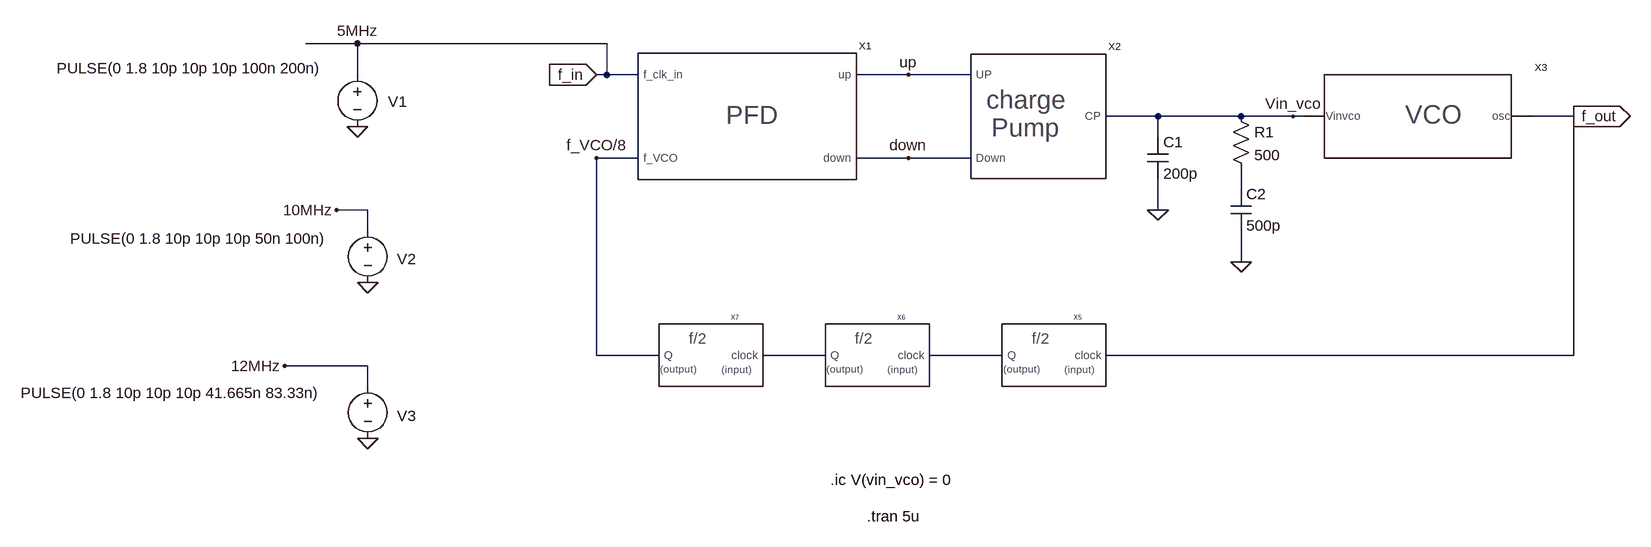
[diagram p0: schematic Final_PLL_501.asc]
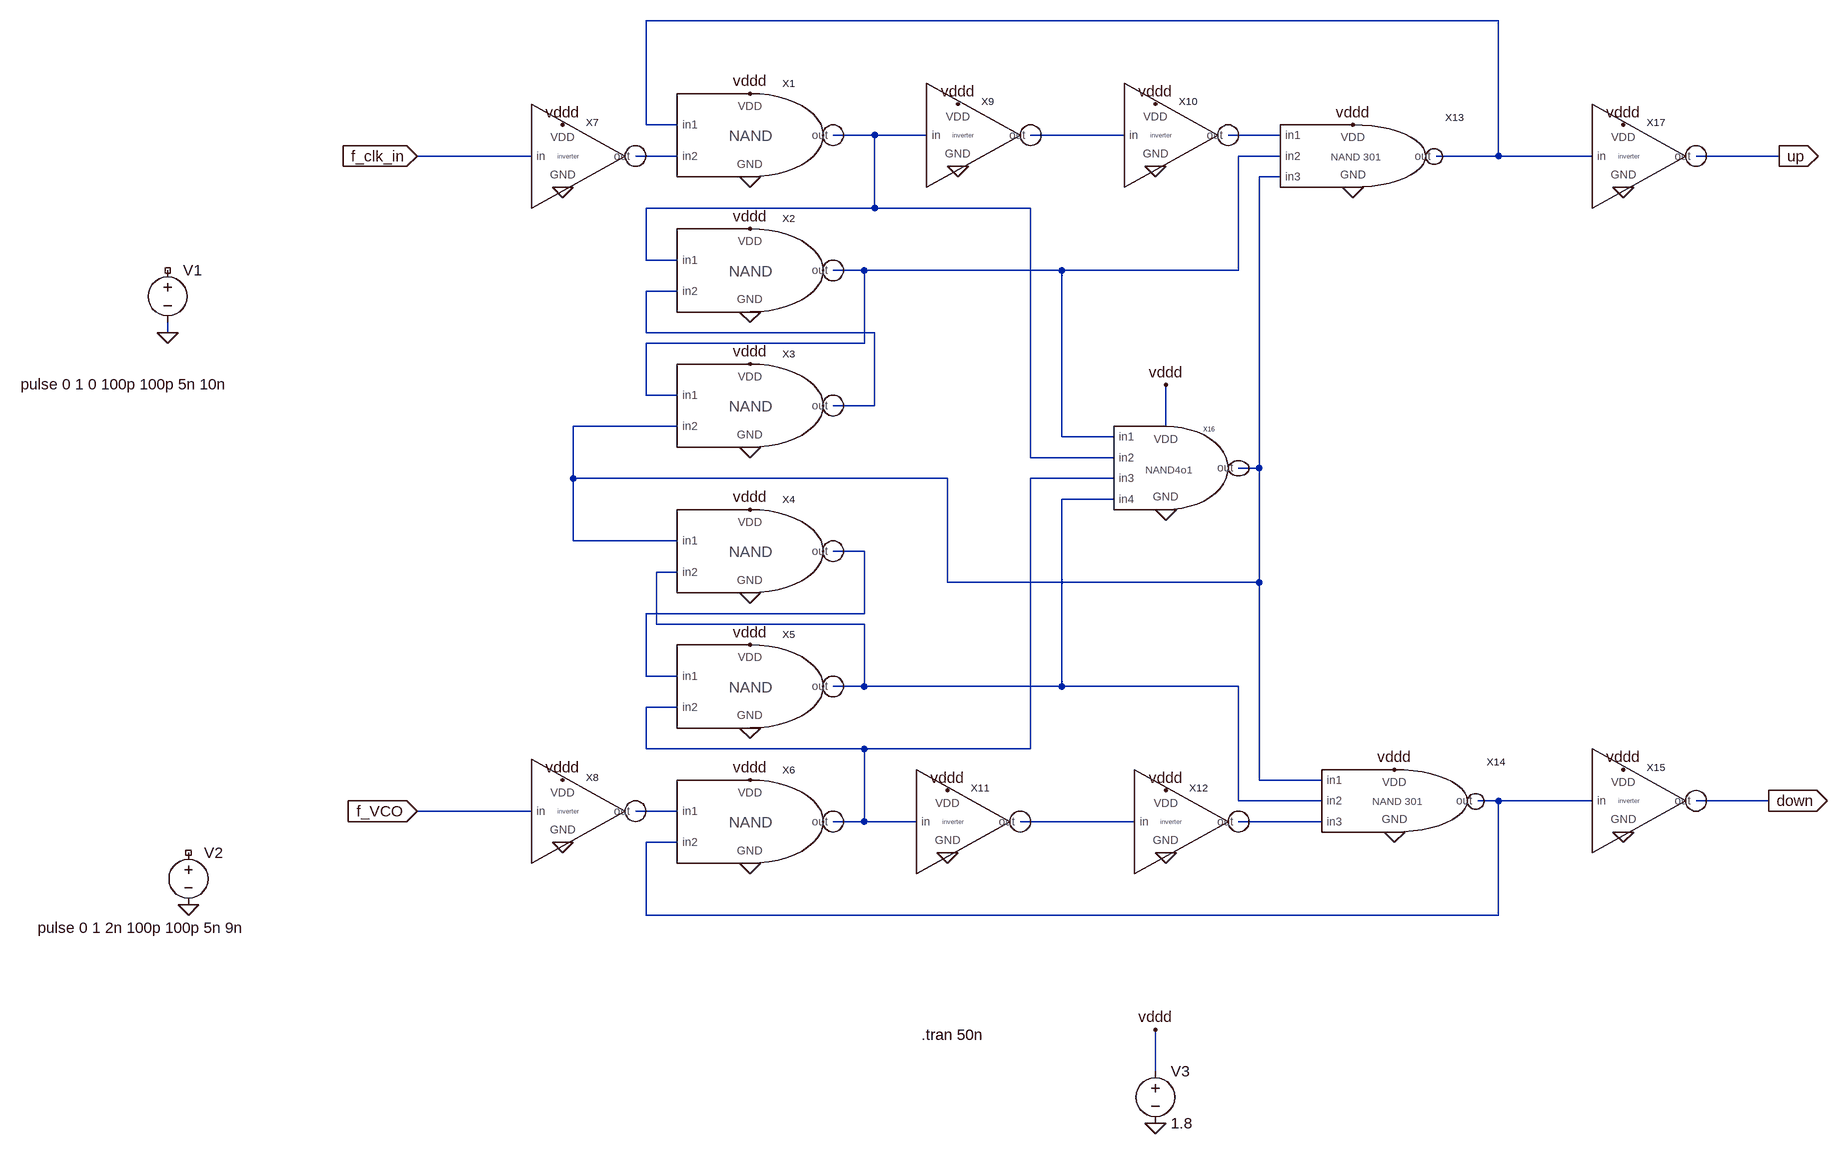
[diagram p1: sub-circuit pfd_501.asc]
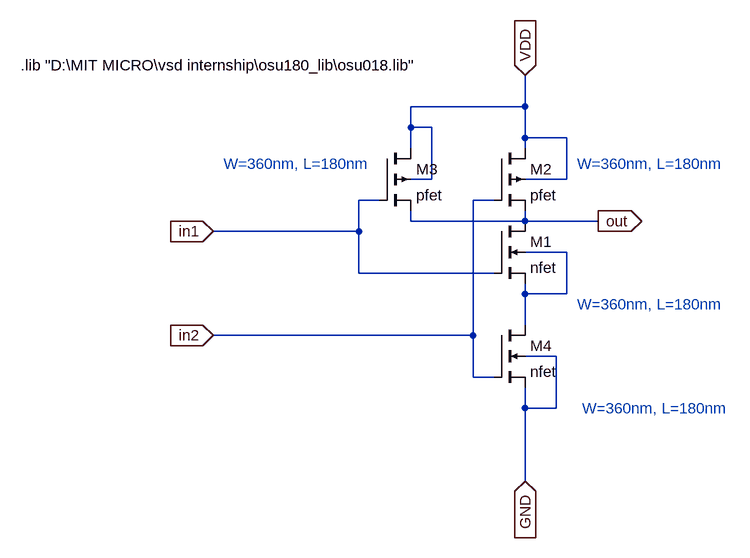
[diagram p2: sub-circuit nand101.asc]
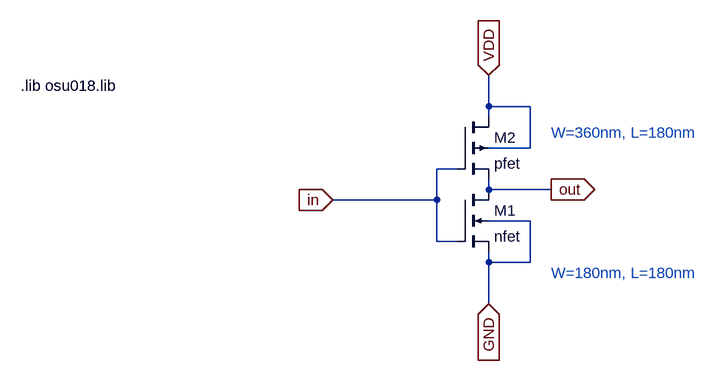
[diagram p3: sub-circuit inv101.asc]
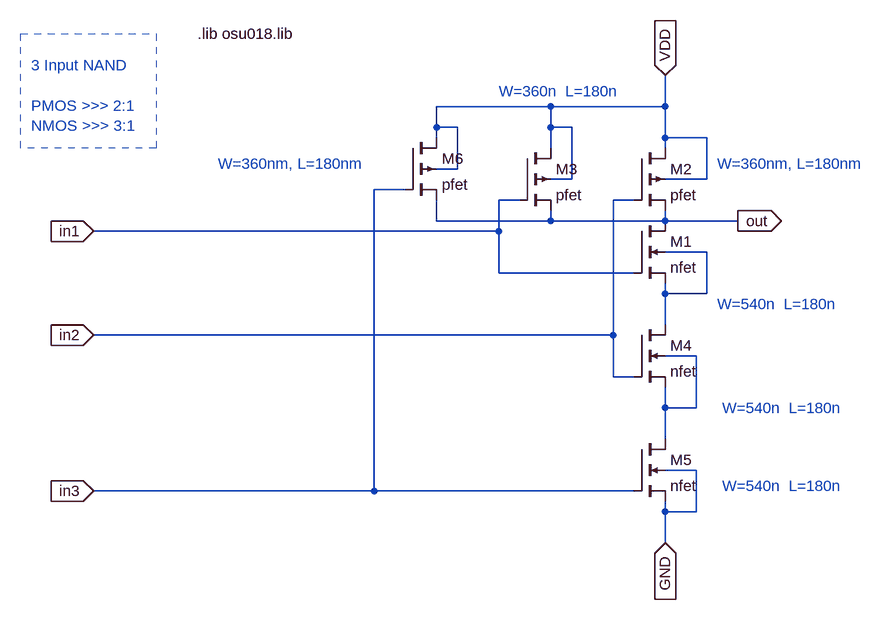
[diagram p4: sub-circuit nand301.asc]
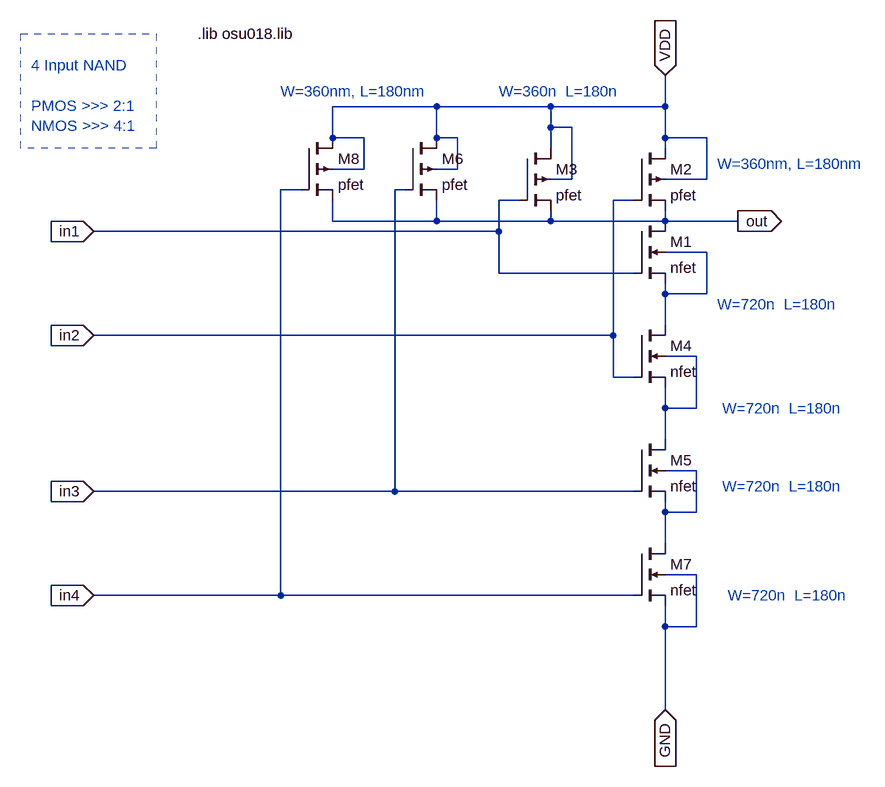
[diagram p5: sub-circuit nand401.asc]
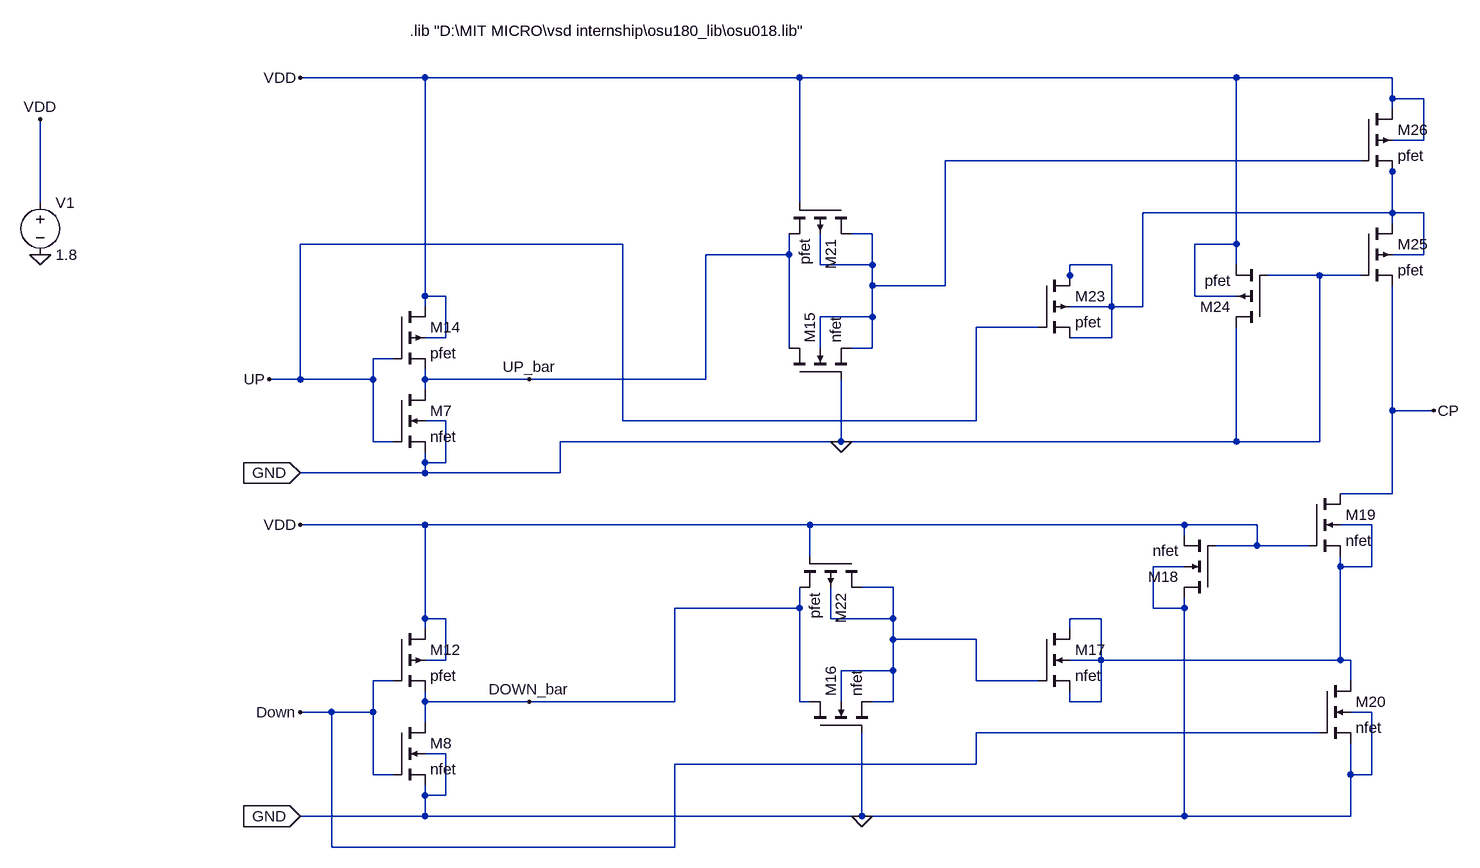
[diagram p6: sub-circuit charge_pump.asc]
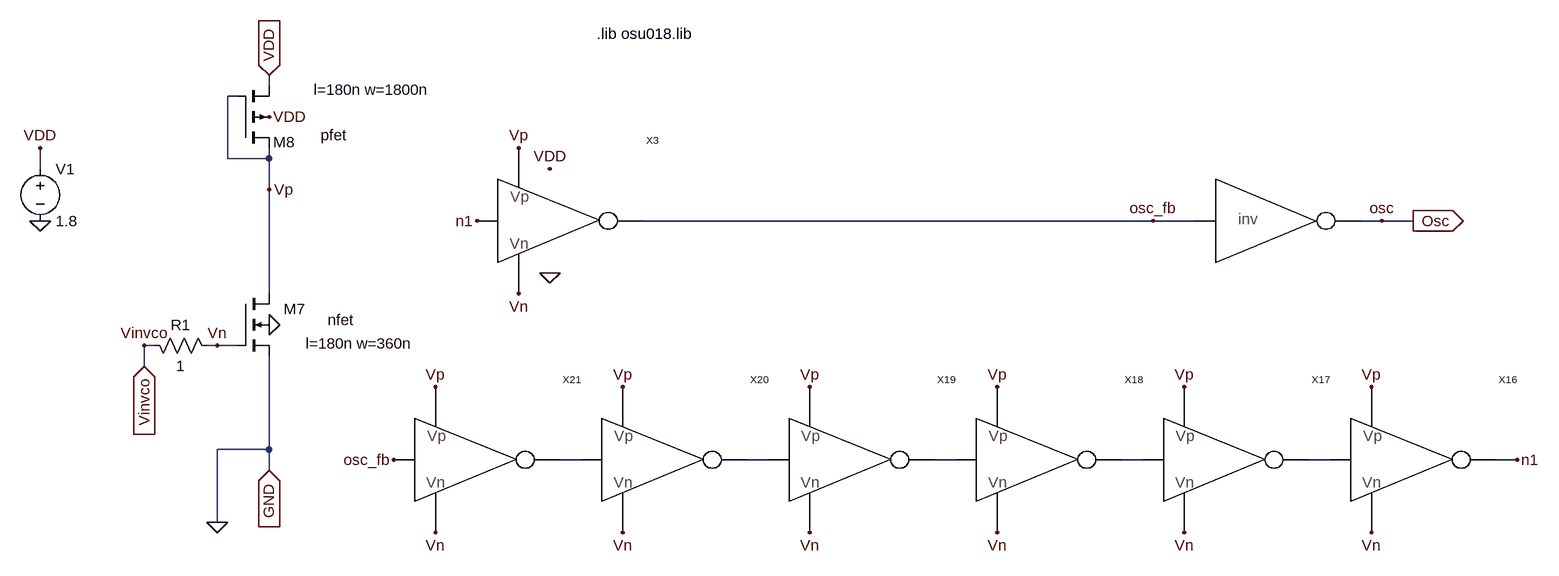
[diagram p7: sub-circuit vco_19_16.asc]
Final_PLL_501.asc, the LTspice schematic file:
Version 4
SHEET 1 1464 760
WIRE -528 16 -608 16
WIRE -144 16 -528 16
WIRE -528 64 -528 16
WIRE -144 64 -144 16
WIRE -144 64 -160 64
WIRE -96 64 -144 64
WIRE 320 64 240 64
WIRE 416 64 320 64
WIRE 704 128 624 128
WIRE 832 128 704 128
WIRE 912 128 832 128
WIRE 928 128 912 128
WIRE 1344 128 1280 128
WIRE 704 160 704 128
WIRE -96 192 -160 192
WIRE 320 192 240 192
WIRE 416 192 320 192
WIRE 832 240 832 208
WIRE -512 272 -560 272
WIRE 704 272 704 224
WIRE -512 304 -512 272
WIRE 832 352 832 304
WIRE -160 496 -160 192
WIRE -64 496 -160 496
WIRE 192 496 96 496
WIRE 464 496 352 496
WIRE 1344 496 1344 128
WIRE 1344 496 624 496
WIRE -512 512 -640 512
WIRE -512 544 -512 512
FLAG 1344 128 f_out
IOPIN 1344 128 Out
FLAG -160 64 f_in
IOPIN -160 64 In
FLAG -528 144 0
FLAG -512 384 0
FLAG -512 624 0
FLAG -528 16 5MHz
FLAG -560 272 10MHz
FLAG -640 512 12MHz
FLAG 320 64 up
FLAG 320 192 down
FLAG 912 128 Vin_vco
FLAG -160 192 f_VCO/8
FLAG 832 352 0
FLAG 704 272 0
SYMBOL pfd_501 80 128 R0
SYMATTR InstName X1
SYMBOL charge_pump 480 112 R0
SYMATTR InstName X2
SYMBOL VCO_19_16 880 128 R0
SYMATTR InstName X3
SYMBOL freq_div_2 544 496 R0
SYMATTR InstName X5
SYMBOL freq_div_2 272 496 R0
SYMATTR InstName X6
SYMBOL freq_div_2 16 496 R0
SYMATTR InstName X7
SYMBOL voltage -528 48 R0
WINDOW 3 -463 6 Left 2
WINDOW 123 0 0 Left 0
WINDOW 39 0 0 Left 0
WINDOW 0 47 57 Left 2
SYMATTR Value PULSE(0 1.8 10p 10p 10p 100n 200n)
SYMATTR InstName V1
SYMBOL voltage -512 288 R0
WINDOW 3 -458 28 Left 2
WINDOW 123 0 0 Left 0
WINDOW 39 0 0 Left 0
WINDOW 0 45 60 Left 2
SYMATTR Value PULSE(0 1.8 10p 10p 10p 50n 100n)
SYMATTR InstName V2
SYMBOL voltage -512 528 R0
WINDOW 3 -534 26 Left 2
WINDOW 123 0 0 Left 0
WINDOW 39 0 0 Left 0
WINDOW 0 45 61 Left 2
SYMATTR Value PULSE(0 1.8 10p 10p 10p 41.665n 83.33n)
SYMATTR InstName V3
SYMBOL cap 688 160 R0
SYMATTR InstName C1
SYMATTR Value 200p
SYMBOL cap 816 240 R0
SYMATTR InstName C2
SYMATTR Value 500p
SYMBOL res 816 112 R0
SYMATTR InstName R1
SYMATTR Value 500
TEXT 256 744 Left 2 !.tran 5u
TEXT 200 688 Left 2 !.ic V(vin_vco) = 0

pfd_501.asc, the sub-circuit schematic file:
Version 4
SHEET 1 2504 1444
WIRE 1248 -272 -64 -272
WIRE -64 -112 -64 -272
WIRE -16 -112 -64 -112
WIRE 288 -96 224 -96
WIRE 368 -96 288 -96
WIRE 672 -96 528 -96
WIRE 912 -96 832 -96
WIRE -240 -64 -416 -64
WIRE -16 -64 -80 -64
WIRE 912 -64 848 -64
WIRE 1248 -64 1248 -272
WIRE 1248 -64 1152 -64
WIRE 1392 -64 1248 -64
WIRE 1680 -64 1552 -64
WIRE 912 -32 880 -32
WIRE 288 16 288 -96
WIRE 288 16 -64 16
WIRE 528 16 288 16
WIRE -64 96 -64 16
WIRE -16 96 -64 96
WIRE 272 112 224 112
WIRE 576 112 272 112
WIRE 848 112 848 -64
WIRE 848 112 576 112
WIRE -16 144 -64 144
WIRE -800 208 -800 192
WIRE -64 208 -64 144
WIRE 288 208 -64 208
WIRE 272 224 272 112
WIRE 272 224 -64 224
WIRE -64 304 -64 224
WIRE -16 304 -64 304
WIRE 288 320 288 208
WIRE 288 320 224 320
WIRE -16 352 -176 352
WIRE 736 352 736 288
WIRE 576 368 576 112
WIRE 656 368 576 368
WIRE 528 400 528 16
WIRE 656 400 528 400
WIRE 880 416 880 -32
WIRE 880 416 848 416
WIRE -176 432 -176 352
WIRE 400 432 -176 432
WIRE 656 432 528 432
WIRE 656 464 576 464
WIRE -176 528 -176 432
WIRE -16 528 -176 528
WIRE 272 544 224 544
WIRE -16 576 -48 576
WIRE 400 592 400 432
WIRE 880 592 880 416
WIRE 880 592 400 592
WIRE 272 640 272 544
WIRE 272 640 -64 640
WIRE -48 656 -48 576
WIRE 272 656 -48 656
WIRE -64 736 -64 640
WIRE -16 736 -64 736
WIRE 272 752 272 656
WIRE 272 752 224 752
WIRE 576 752 576 464
WIRE 576 752 272 752
WIRE 848 752 576 752
WIRE -16 784 -64 784
WIRE -64 848 -64 784
WIRE 272 848 -64 848
WIRE 528 848 528 432
WIRE 528 848 272 848
WIRE 880 896 880 592
WIRE 976 896 880 896
WIRE 848 928 848 752
WIRE 976 928 848 928
WIRE 1248 928 1216 928
WIRE 1392 928 1248 928
WIRE 1664 928 1552 928
WIRE -240 944 -416 944
WIRE -16 944 -80 944
WIRE 272 960 272 848
WIRE 272 960 224 960
WIRE 352 960 272 960
WIRE 688 960 512 960
WIRE 976 960 848 960
WIRE -16 992 -64 992
WIRE -64 1104 -64 992
WIRE 1248 1104 1248 928
WIRE 1248 1104 -64 1104
WIRE 720 1344 720 1280
FLAG -416 -64 f_clk_in
IOPIN -416 -64 In
FLAG -416 944 f_VCO
IOPIN -416 944 In
FLAG 1680 -64 up
IOPIN 1680 -64 Out
FLAG 1664 928 down
IOPIN 1664 928 Out
FLAG -800 208 0
FLAG -768 1088 0
FLAG 1440 -16 0
FLAG 1024 -16 0
FLAG 720 -48 0
FLAG 416 -48 0
FLAG 96 -32 0
FLAG 96 176 0
FLAG 96 384 0
FLAG 96 608 0
FLAG -192 -16 0
FLAG 96 816 0
FLAG 96 1024 0
FLAG 400 1008 0
FLAG 736 1008 0
FLAG 1088 976 0
FLAG 1440 976 0
FLAG -192 992 0
FLAG -192 -112 vddd
FLAG 96 -160 vddd
FLAG 416 -144 vddd
FLAG 720 -144 vddd
FLAG 96 48 vddd
FLAG 1024 -112 vddd
FLAG 1440 -112 vddd
FLAG 736 288 vddd
FLAG 96 256 vddd
FLAG 96 480 vddd
FLAG 96 688 vddd
FLAG 96 896 vddd
FLAG 400 912 vddd
FLAG 736 912 vddd
FLAG 1088 880 vddd
FLAG -192 896 vddd
FLAG 1440 880 vddd
FLAG 720 1424 0
FLAG 720 1280 vddd
FLAG 736 480 0
SYMBOL nand101 64 -96 R0
SYMATTR InstName X1
SYMBOL nand101 64 112 R0
SYMATTR InstName X2
SYMBOL nand101 64 320 R0
SYMATTR InstName X3
SYMBOL nand101 64 544 R0
SYMATTR InstName X4
SYMBOL nand101 64 752 R0
SYMATTR InstName X5
SYMBOL nand101 64 960 R0
SYMATTR InstName X6
SYMBOL inv101 -192 -64 R0
SYMATTR InstName X7
SYMBOL inv101 -192 944 R0
SYMATTR InstName X8
SYMBOL inv101 416 -96 R0
SYMATTR InstName X9
SYMBOL inv101 720 -96 R0
SYMATTR InstName X10
SYMBOL inv101 400 960 R0
SYMATTR InstName X11
SYMBOL inv101 736 960 R0
SYMATTR InstName X12
SYMBOL nand301 976 -64 R0
SYMATTR InstName X13
SYMBOL nand301 1040 928 R0
SYMATTR InstName X14
SYMBOL inv101 1440 928 R0
SYMATTR InstName X15
SYMBOL nand401 720 400 R0
SYMATTR InstName X16
SYMBOL inv101 1440 -64 R0
SYMATTR InstName X17
SYMBOL voltage -800 96 R0
WINDOW 3 -226 191 Left 2
WINDOW 123 0 0 Left 0
WINDOW 39 0 0 Left 0
SYMATTR Value pulse 0 1 0 100p 100p 5n 10n
SYMATTR InstName V1
SYMBOL voltage -768 992 R0
WINDOW 3 -232 131 Left 2
WINDOW 123 0 0 Left 0
WINDOW 39 0 0 Left 0
SYMATTR Value pulse 0 1 2n 100p 100p 5n 9n
SYMATTR InstName V2
SYMBOL voltage 720 1328 R0
WINDOW 123 0 0 Left 0
WINDOW 39 0 0 Left 0
SYMATTR InstName V3
SYMATTR Value 1.8
TEXT 360 1288 Left 2 !.tran 50n

nand101.asc, the sub-circuit schematic file:
Version 4
SHEET 1 880 708
WIRE 272 0 272 -48
WIRE 272 0 96 0
WIRE 96 32 96 0
WIRE 128 32 96 32
WIRE 272 48 272 0
WIRE 336 48 272 48
WIRE 96 64 96 32
WIRE 272 64 272 48
WIRE 128 112 128 32
WIRE 128 112 96 112
WIRE 336 112 336 48
WIRE 336 112 272 112
WIRE 48 144 16 144
WIRE 224 144 192 144
WIRE 96 176 96 160
WIRE 272 176 272 160
WIRE 272 176 96 176
WIRE 384 176 272 176
WIRE 16 192 16 144
WIRE 16 192 -208 192
WIRE 336 224 272 224
WIRE 16 256 16 192
WIRE 224 256 16 256
WIRE 272 288 272 272
WIRE 336 288 336 224
WIRE 336 288 272 288
WIRE 272 336 272 288
WIRE 192 352 192 144
WIRE 192 352 -208 352
WIRE 320 384 272 384
WIRE 192 416 192 352
WIRE 224 416 192 416
WIRE 272 464 272 432
WIRE 320 464 320 384
WIRE 320 464 272 464
WIRE 272 576 272 464
FLAG 384 176 out
IOPIN 384 176 Out
FLAG -208 192 in1
IOPIN -208 192 In
FLAG 272 -48 VDD
IOPIN 272 -48 In
FLAG 272 576 GND
IOPIN 272 576 In
FLAG -208 352 in2
IOPIN -208 352 In
SYMBOL nmos4 224 176 R0
SYMATTR InstName M1
SYMATTR Value2 l=180n w=180n
SYMATTR Value nfet
SYMBOL pmos4 224 64 R0
SYMATTR InstName M2
SYMATTR Value2 l=180n w=360n
SYMATTR Value pfet
SYMBOL pmos4 48 64 R0
SYMATTR InstName M3
SYMATTR Value pfet
SYMATTR Value2 l=180n w=360n
SYMBOL nmos4 224 336 R0
SYMATTR InstName M4
SYMATTR Value nfet
SYMATTR Value2 l=180n w=360n
TEXT -504 -64 Left 2 !.lib "D:\\MIT MICRO\\vsd internship\\osu180_lib\\osu018.lib"
TEXT 352 304 Left 2 ;W=360nm, L=180nm
TEXT 352 88 Left 2 ;W=360nm, L=180nm
TEXT 360 464 Left 2 ;W=360nm, L=180nm
TEXT -192 88 Left 2 ;W=360nm, L=180nm

inv101.asc, the sub-circuit schematic file:
Version 4
SHEET 1 880 680
WIRE 256 48 256 0
WIRE 320 48 256 48
WIRE 256 64 256 48
WIRE 320 112 320 48
WIRE 320 112 256 112
WIRE 208 144 176 144
WIRE 256 176 256 160
WIRE 352 176 256 176
WIRE 176 192 176 144
WIRE 176 192 16 192
WIRE 320 224 256 224
WIRE 176 256 176 192
WIRE 208 256 176 256
WIRE 256 288 256 272
WIRE 320 288 320 224
WIRE 320 288 256 288
WIRE 256 352 256 288
FLAG 352 176 out
IOPIN 352 176 Out
FLAG 16 192 in
IOPIN 16 192 In
FLAG 256 0 VDD
IOPIN 256 0 In
FLAG 256 352 GND
IOPIN 256 352 In
SYMBOL nmos4 208 176 R0
SYMATTR InstName M1
SYMATTR Value2 l=180n w=180n
SYMATTR Value nfet
SYMBOL pmos4 208 64 R0
SYMATTR InstName M2
SYMATTR Value2 l=180n w=360n
SYMATTR Value pfet
TEXT -464 16 Left 2 !.lib osu018.lib
TEXT 352 304 Left 2 ;W=180nm, L=180nm
TEXT 352 88 Left 2 ;W=360nm, L=180nm

nand301.asc, the sub-circuit schematic file:
Version 4
SHEET 1 916 896
WIRE 96 0 -80 0
WIRE 272 0 272 -48
WIRE 272 0 96 0
WIRE -80 32 -80 0
WIRE -48 32 -80 32
WIRE 96 32 96 0
WIRE 128 32 96 32
WIRE -80 48 -80 32
WIRE 272 48 272 0
WIRE 336 48 272 48
WIRE 96 64 96 32
WIRE 272 64 272 48
WIRE -48 96 -48 32
WIRE -48 96 -80 96
WIRE 128 112 128 32
WIRE 128 112 96 112
WIRE 336 112 336 48
WIRE 336 112 272 112
WIRE -128 128 -176 128
WIRE 48 144 16 144
WIRE 224 144 192 144
WIRE -80 176 -80 144
WIRE 96 176 96 160
WIRE 96 176 -80 176
WIRE 272 176 272 160
WIRE 272 176 96 176
WIRE 384 176 272 176
WIRE 16 192 16 144
WIRE 16 192 -608 192
WIRE 336 224 272 224
WIRE 16 256 16 192
WIRE 224 256 16 256
WIRE 272 288 272 272
WIRE 336 288 336 224
WIRE 336 288 272 288
WIRE 272 336 272 288
WIRE 192 352 192 144
WIRE 192 352 -608 352
WIRE 320 384 272 384
WIRE 192 416 192 352
WIRE 224 416 192 416
WIRE 272 464 272 432
WIRE 320 464 320 384
WIRE 320 464 272 464
WIRE 272 512 272 464
WIRE 320 560 272 560
WIRE -176 592 -176 128
WIRE -176 592 -608 592
WIRE 224 592 -176 592
WIRE 272 624 272 608
WIRE 320 624 320 560
WIRE 320 624 272 624
WIRE 272 672 272 624
FLAG 384 176 out
IOPIN 384 176 Out
FLAG -608 192 in1
IOPIN -608 192 In
FLAG 272 -48 VDD
IOPIN 272 -48 In
FLAG 272 672 GND
IOPIN 272 672 In
FLAG -608 352 in2
IOPIN -608 352 In
FLAG -608 592 in3
IOPIN -608 592 In
SYMBOL nmos4 224 176 R0
SYMATTR InstName M1
SYMATTR Value2 l=180n w=540n
SYMATTR Value nfet
SYMBOL pmos4 224 64 R0
SYMATTR InstName M2
SYMATTR Value2 l=180n w=360n
SYMATTR Value pfet
SYMBOL pmos4 48 64 R0
SYMATTR InstName M3
SYMATTR Value pfet
SYMATTR Value2 l=180n w=360n
SYMBOL nmos4 224 336 R0
SYMATTR InstName M4
SYMATTR Value nfet
SYMATTR Value2 l=180n w=540n
SYMBOL nmos4 224 512 R0
SYMATTR InstName M5
SYMATTR Value nfet
SYMATTR Value2 l=180n w=540n
SYMBOL pmos4 -128 48 R0
SYMATTR InstName M6
SYMATTR Value pfet
SYMATTR Value2 l=180n w=360n
TEXT -448 -112 Left 2 !.lib osu018.lib
TEXT 352 304 Left 2 ;W=540n  L=180n
TEXT 352 88 Left 2 ;W=360nm, L=180nm
TEXT 360 464 Left 2 ;W=540n  L=180n
TEXT -416 88 Left 2 ;W=360nm, L=180nm
TEXT 360 584 Left 2 ;W=540n  L=180n
TEXT 16 -24 Left 2 ;W=360n  L=180n
TEXT -704 -64 Left 2 ;3 Input NAND\n \nPMOS >>> 2:1\nNMOS >>> 3:1
RECTANGLE Normal -512 64 -720 -112 2

nand401.asc, the sub-circuit schematic file:
Version 4
SHEET 1 916 1040
WIRE -80 0 -240 0
WIRE 96 0 -80 0
WIRE 272 0 272 -48
WIRE 272 0 96 0
WIRE 96 32 96 0
WIRE 128 32 96 32
WIRE -240 48 -240 0
WIRE -192 48 -240 48
WIRE -80 48 -80 0
WIRE -48 48 -80 48
WIRE 272 48 272 0
WIRE 336 48 272 48
WIRE 96 64 96 32
WIRE 272 64 272 48
WIRE -192 96 -192 48
WIRE -192 96 -240 96
WIRE -48 96 -48 48
WIRE -48 96 -80 96
WIRE 128 112 128 32
WIRE 128 112 96 112
WIRE 336 112 336 48
WIRE 336 112 272 112
WIRE -288 128 -320 128
WIRE -128 128 -144 128
WIRE 48 144 16 144
WIRE 224 144 192 144
WIRE -240 176 -240 144
WIRE -80 176 -80 144
WIRE -80 176 -240 176
WIRE 96 176 96 160
WIRE 96 176 -80 176
WIRE 272 176 272 160
WIRE 272 176 96 176
WIRE 384 176 272 176
WIRE 16 192 16 144
WIRE 16 192 -608 192
WIRE 336 224 272 224
WIRE 16 256 16 192
WIRE 224 256 16 256
WIRE 272 288 272 272
WIRE 336 288 336 224
WIRE 336 288 272 288
WIRE 272 336 272 288
WIRE 192 352 192 144
WIRE 192 352 -608 352
WIRE 320 384 272 384
WIRE 192 416 192 352
WIRE 224 416 192 416
WIRE 272 464 272 432
WIRE 320 464 320 384
WIRE 320 464 272 464
WIRE 272 512 272 464
WIRE 320 560 272 560
WIRE -144 592 -144 128
WIRE -144 592 -608 592
WIRE 224 592 -144 592
WIRE 272 624 272 608
WIRE 320 624 320 560
WIRE 320 624 272 624
WIRE 272 672 272 624
WIRE 320 720 272 720
WIRE -320 752 -320 128
WIRE -320 752 -608 752
WIRE 224 752 -320 752
WIRE 272 800 272 768
WIRE 320 800 320 720
WIRE 320 800 272 800
WIRE 272 928 272 800
FLAG 384 176 out
IOPIN 384 176 Out
FLAG -608 192 in1
IOPIN -608 192 In
FLAG 272 -48 VDD
IOPIN 272 -48 In
FLAG 272 928 GND
IOPIN 272 928 In
FLAG -608 352 in2
IOPIN -608 352 In
FLAG -608 592 in3
IOPIN -608 592 In
FLAG -608 752 in4
IOPIN -608 752 In
SYMBOL nmos4 224 176 R0
SYMATTR InstName M1
SYMATTR Value2 l=180n w=720n
SYMATTR Value nfet
SYMBOL pmos4 224 64 R0
SYMATTR InstName M2
SYMATTR Value2 l=180n w=360n
SYMATTR Value pfet
SYMBOL pmos4 48 64 R0
SYMATTR InstName M3
SYMATTR Value pfet
SYMATTR Value2 l=180n w=360n
SYMBOL nmos4 224 336 R0
SYMATTR InstName M4
SYMATTR Value nfet
SYMATTR Value2 l=180n w=720n
SYMBOL nmos4 224 512 R0
SYMATTR InstName M5
SYMATTR Value nfet
SYMATTR Value2 l=180n w=720n
SYMBOL pmos4 -128 48 R0
SYMATTR InstName M6
SYMATTR Value pfet
SYMATTR Value2 l=180n w=360n
SYMBOL nmos4 224 672 R0
SYMATTR InstName M7
SYMATTR Value nfet
SYMATTR Value2 l=180n w=720n
SYMBOL pmos4 -288 48 R0
SYMATTR InstName M8
SYMATTR Value pfet
SYMATTR Value2 l=180n w=360n
TEXT -448 -112 Left 2 !.lib osu018.lib
TEXT 352 304 Left 2 ;W=720n  L=180n
TEXT 352 88 Left 2 ;W=360nm, L=180nm
TEXT 360 464 Left 2 ;W=720n  L=180n
TEXT -320 -24 Left 2 ;W=360nm, L=180nm
TEXT 360 584 Left 2 ;W=720n  L=180n
TEXT 16 -24 Left 2 ;W=360n  L=180n
TEXT -704 -64 Left 2 ;4 Input NAND\n \nPMOS >>> 2:1\nNMOS >>> 4:1
TEXT 368 752 Left 2 ;W=720n  L=180n
RECTANGLE Normal -512 64 -720 -112 2

charge_pump.asc, the sub-circuit schematic file:
Version 4
SHEET 1 2360 948
WIRE 496 -288 304 -288
WIRE 1072 -288 496 -288
WIRE 1744 -288 1072 -288
WIRE 1984 -288 1744 -288
WIRE 1984 -256 1984 -288
WIRE 2032 -256 1984 -256
WIRE 1984 -240 1984 -256
WIRE 2032 -192 2032 -256
WIRE 2032 -192 1984 -192
WIRE 1936 -160 1296 -160
WIRE 1984 -144 1984 -160
WIRE -96 -96 -96 -224
WIRE 1072 -96 1072 -288
WIRE 1984 -80 1984 -144
WIRE 1984 -80 1600 -80
WIRE 2032 -80 1984 -80
WIRE 1984 -64 1984 -80
WIRE 1184 -48 1152 -48
WIRE 800 -32 304 -32
WIRE 1744 -32 1744 -288
WIRE 1744 -32 1680 -32
WIRE 1056 -16 1056 -48
WIRE 1056 -16 928 -16
WIRE 2032 -16 2032 -80
WIRE 2032 -16 1984 -16
WIRE 1104 0 1104 -48
WIRE 1184 0 1184 -48
WIRE 1184 0 1104 0
WIRE 1552 0 1488 0
WIRE 1744 0 1744 -32
WIRE 1488 16 1488 0
WIRE 1872 16 1792 16
WIRE 1936 16 1872 16
WIRE 1184 32 1184 0
WIRE 1296 32 1296 -160
WIRE 1296 32 1184 32
WIRE 1488 32 1488 16
WIRE 496 48 496 -288
WIRE 528 48 496 48
WIRE 1680 48 1680 -32
WIRE 1744 48 1680 48
WIRE 496 64 496 48
WIRE 1552 64 1552 0
WIRE 1552 64 1488 64
WIRE 1600 64 1600 -80
WIRE 1600 64 1552 64
WIRE 1184 80 1184 32
WIRE 1184 80 1104 80
WIRE 1440 96 1344 96
WIRE 528 112 528 48
WIRE 528 112 496 112
WIRE 1552 112 1552 64
WIRE 1552 112 1488 112
WIRE 1056 128 1056 -16
WIRE 1104 128 1104 80
WIRE 1184 128 1184 80
WIRE 1184 128 1152 128
WIRE 448 144 416 144
WIRE 304 176 304 -32
WIRE 304 176 256 176
WIRE 416 176 416 144
WIRE 416 176 304 176
WIRE 496 176 496 160
WIRE 656 176 496 176
WIRE 928 176 928 -16
WIRE 928 176 656 176
WIRE 496 192 496 176
WIRE 1984 224 1984 32
WIRE 2048 224 1984 224
WIRE 528 240 496 240
WIRE 800 240 800 -32
WIRE 1344 240 1344 96
WIRE 1344 240 800 240
WIRE 416 272 416 176
WIRE 448 272 416 272
WIRE 1136 272 1136 176
WIRE 1136 272 704 272
WIRE 1744 272 1744 96
WIRE 1744 272 1136 272
WIRE 1872 272 1872 16
WIRE 1872 272 1744 272
WIRE 496 304 496 288
WIRE 528 304 528 240
WIRE 528 304 496 304
WIRE 496 320 496 304
WIRE 496 320 304 320
WIRE 704 320 704 272
WIRE 704 320 496 320
WIRE 1984 352 1984 224
WIRE 1984 352 1904 352
WIRE 496 400 304 400
WIRE 1088 400 496 400
WIRE 1664 400 1088 400
WIRE 1776 400 1664 400
WIRE 1952 400 1904 400
WIRE 1664 416 1664 400
WIRE 1776 432 1776 400
WIRE 1776 432 1712 432
WIRE 1856 432 1776 432
WIRE 1088 448 1088 400
WIRE 1664 464 1616 464
WIRE 1904 464 1904 448
WIRE 1952 464 1952 400
WIRE 1952 464 1904 464
WIRE 1216 496 1168 496
WIRE 1072 528 1072 496
WIRE 1072 528 880 528
WIRE 1616 528 1616 464
WIRE 1664 528 1664 512
WIRE 1664 528 1616 528
WIRE 496 544 496 400
WIRE 528 544 496 544
WIRE 1120 544 1120 496
WIRE 1216 544 1216 496
WIRE 1216 544 1120 544
WIRE 1536 544 1488 544
WIRE 496 560 496 544
WIRE 1488 560 1488 544
WIRE 1216 576 1216 544
WIRE 1344 576 1216 576
WIRE 528 608 528 544
WIRE 528 608 496 608
WIRE 1536 608 1536 544
WIRE 1536 608 1488 608
WIRE 1904 608 1904 464
WIRE 1904 608 1536 608
WIRE 1920 608 1904 608
WIRE 1216 624 1216 576
WIRE 1216 624 1136 624
WIRE 448 640 416 640
WIRE 1344 640 1344 576
WIRE 1440 640 1344 640
WIRE 1920 640 1920 608
WIRE 496 672 496 656
WIRE 656 672 496 672
WIRE 880 672 880 528
WIRE 880 672 656 672
WIRE 1072 672 1072 528
WIRE 1088 672 1072 672
WIRE 1136 672 1136 624
WIRE 1216 672 1216 624
WIRE 1216 672 1184 672
WIRE 1488 672 1488 656
WIRE 1536 672 1536 608
WIRE 1536 672 1488 672
WIRE 352 688 304 688
WIRE 416 688 416 640
WIRE 416 688 352 688
WIRE 1952 688 1920 688
WIRE 496 704 496 672
WIRE 1872 720 1344 720
WIRE 528 752 496 752
WIRE 1344 768 1344 720
WIRE 1344 768 880 768
WIRE 416 784 416 688
WIRE 448 784 416 784
WIRE 1920 784 1920 736
WIRE 1952 784 1952 688
WIRE 1952 784 1920 784
WIRE 496 816 496 800
WIRE 528 816 528 752
WIRE 528 816 496 816
WIRE 496 848 496 816
WIRE 496 848 304 848
WIRE 1168 848 1168 720
WIRE 1168 848 496 848
WIRE 1664 848 1664 528
WIRE 1664 848 1168 848
WIRE 1920 848 1920 784
WIRE 1920 848 1664 848
WIRE 352 896 352 688
WIRE 880 896 880 768
WIRE 880 896 352 896
FLAG 656 176 UP_bar
FLAG 656 672 DOWN_bar
FLAG 2048 224 CP
FLAG 304 688 Down
FLAG 304 400 VDD
FLAG 304 -288 VDD
FLAG 304 848 GND
IOPIN 304 848 In
FLAG 304 320 GND
IOPIN 304 320 In
FLAG 256 176 UP
FLAG -96 -16 0
FLAG -96 -224 VDD
FLAG 1136 272 0
FLAG 1168 848 0
SYMBOL nmos4 448 192 R0
SYMATTR InstName M7
SYMATTR Value2 l=180n w=180n
SYMATTR Value nfet
SYMBOL nmos4 448 704 R0
SYMATTR InstName M8
SYMATTR Value2 l=180n w=180n
SYMATTR Value nfet
SYMBOL pmos4 448 560 R0
SYMATTR InstName M12
SYMATTR Value2 l=180n w=540n
SYMATTR Value pfet
SYMBOL pmos4 448 64 R0
SYMATTR InstName M14
SYMATTR Value2 l=180n w=540n
SYMATTR Value pfet
SYMBOL nmos4 1056 176 R270
SYMATTR InstName M15
SYMATTR Value nfet
SYMATTR Value2 l=180n w=180n
SYMBOL nmos4 1088 720 R270
SYMATTR InstName M16
SYMATTR Value nfet
SYMATTR Value2 l=180n w=180n
SYMBOL nmos4 1440 560 R0
SYMATTR InstName M17
SYMATTR Value nfet
SYMATTR Value2 l=180n w=180n
SYMBOL nmos4 1712 512 R180
SYMATTR InstName M18
SYMATTR Value nfet
SYMATTR Value2 l=180n w=180n
SYMBOL nmos4 1856 352 R0
SYMATTR InstName M19
SYMATTR Value nfet
SYMATTR Value2 l=180n w=180n
SYMBOL nmos4 1872 640 R0
SYMATTR InstName M20
SYMATTR Value nfet
SYMATTR Value2 l=180n w=15u
SYMBOL pmos4 1152 -96 R90
SYMATTR InstName M21
SYMATTR Value pfet
SYMATTR Value2 l=180n w=540n
SYMBOL pmos4 1168 448 R90
SYMATTR InstName M22
SYMATTR Value pfet
SYMATTR Value2 l=180n w=540n
SYMBOL pmos4 1440 16 R0
SYMATTR InstName M23
SYMATTR Value pfet
SYMATTR Value2 l=180n w=540n
SYMBOL pmos4 1792 96 R180
SYMATTR InstName M24
SYMATTR Value pfet
SYMATTR Value2 l=180n w=540n
SYMBOL pmos4 1936 -64 R0
SYMATTR InstName M25
SYMATTR Value pfet
SYMATTR Value2 l=180n w=540n
SYMBOL pmos4 1936 -240 R0
SYMATTR InstName M26
SYMATTR Value pfet
SYMATTR Value2 l=180n w=45u
SYMBOL voltage -96 -112 R0
WINDOW 123 0 0 Left 0
WINDOW 39 0 0 Left 0
SYMATTR InstName V1
SYMATTR Value 1.8
TEXT 472 -360 Left 2 !.lib "D:\\MIT MICRO\\vsd internship\\osu180_lib\\osu018.lib"

vco_19_16.asc, the sub-circuit schematic file:
Version 4
SHEET 1 6288 680
WIRE 816 -976 816 -992
WIRE 768 -960 752 -960
WIRE 752 -864 752 -960
WIRE 816 -864 816 -880
WIRE 816 -864 752 -864
WIRE 464 -848 464 -880
WIRE 816 -816 816 -864
WIRE 2176 -768 1392 -768
WIRE 2240 -768 2176 -768
WIRE 2528 -768 2496 -768
WIRE 2576 -768 2528 -768
WIRE 816 -656 816 -816
WIRE 640 -576 624 -576
WIRE 736 -576 720 -576
WIRE 768 -576 736 -576
WIRE 624 -544 624 -576
WIRE 816 -416 816 -560
WIRE 816 -416 736 -416
WIRE 1296 -400 1264 -400
WIRE 1584 -400 1552 -400
WIRE 1872 -400 1840 -400
WIRE 2160 -400 2128 -400
WIRE 2448 -400 2416 -400
WIRE 2736 -400 2704 -400
WIRE 816 -384 816 -416
WIRE 736 -304 736 -416
FLAG 624 -576 Vinvco
FLAG 816 -608 0
FLAG 816 -928 VDD
FLAG 816 -816 Vp
FLAG 1072 -512 Vp
FLAG 1072 -288 Vn
FLAG 736 -576 Vn
FLAG 1360 -512 Vp
FLAG 1360 -288 Vn
FLAG 1648 -512 Vp
FLAG 1648 -288 Vn
FLAG 1936 -512 Vp
FLAG 1936 -288 Vn
FLAG 2224 -512 Vp
FLAG 2224 -288 Vn
FLAG 2512 -512 Vp
FLAG 2512 -288 Vn
FLAG 1248 -848 VDD
FLAG 1248 -688 0
FLAG 1200 -880 Vp
FLAG 1200 -656 Vn
FLAG 2528 -768 osc
FLAG 2176 -768 osc_fb
FLAG 1008 -400 osc_fb
FLAG 2736 -400 n1
FLAG 1136 -768 n1
FLAG 816 -992 VDD
IOPIN 816 -992 In
FLAG 816 -384 GND
IOPIN 816 -384 In
FLAG 624 -544 Vinvco
IOPIN 624 -544 In
FLAG 2576 -768 Osc
IOPIN 2576 -768 Out
FLAG 464 -768 0
FLAG 464 -880 VDD
FLAG 736 -304 0
SYMBOL nmos4 768 -656 R0
WINDOW 0 104 24 Right 2
WINDOW 3 179 41 Right 2
WINDOW 123 270 77 Right 2
SYMATTR InstName M7
SYMATTR Value nfet
SYMATTR Value2 l=180n w=360n
SYMBOL pmos4 768 -880 M180
WINDOW 0 88 9 Right 2
WINDOW 3 168 20 Right 2
WINDOW 123 296 90 Right 2
SYMATTR InstName M8
SYMATTR Value pfet
SYMATTR Value2 l=180n w=1800n
SYMBOL res 736 -560 M270
WINDOW 0 32 56 VTop 2
WINDOW 3 0 56 VBottom 2
SYMATTR InstName R1
SYMATTR Value 1
SYMBOL INV_20_10 2272 -832 R0
WINDOW 0 0 0 Invisible 0
SYMATTR InstName U22
SYMBOL CS_inv 1168 -832 R0
SYMATTR InstName X3
SYMBOL CS_inv 2480 -464 R0
SYMATTR InstName X16
SYMBOL CS_inv 2192 -464 R0
SYMATTR InstName X17
SYMBOL CS_inv 1904 -464 R0
SYMATTR InstName X18
SYMBOL CS_inv 1616 -464 R0
SYMATTR InstName X19
SYMBOL CS_inv 1328 -464 R0
SYMATTR InstName X20
SYMBOL CS_inv 1040 -464 R0
SYMATTR InstName X21
SYMBOL voltage 464 -864 R0
WINDOW 123 0 0 Left 0
WINDOW 39 0 0 Left 0
SYMATTR InstName V1
SYMATTR Value 1.8
TEXT 1320 -1056 Left 2 !.lib osu018.lib

inv_20_10.asc, the sub-circuit schematic file:
Version 4
SHEET 1 1196 680
WIRE 448 -432 256 -432
WIRE 256 -400 256 -432
WIRE 448 -304 448 -432
WIRE 464 -304 448 -304
WIRE 400 -288 368 -288
WIRE 464 -256 464 -304
WIRE 464 -256 448 -256
WIRE 368 -176 368 -288
WIRE 368 -176 304 -176
WIRE 448 -176 448 -208
WIRE 624 -176 448 -176
WIRE 464 -128 448 -128
WIRE 368 -96 368 -176
WIRE 400 -96 368 -96
WIRE 464 -80 464 -128
WIRE 464 -80 448 -80
WIRE 448 -32 448 -80
FLAG 304 -176 In
IOPIN 304 -176 In
FLAG 624 -176 Out
IOPIN 624 -176 Out
FLAG 448 -32 0
FLAG 256 -320 0
SYMBOL nmos4 400 -176 R0
WINDOW 0 119 20 Right 2
WINDOW 3 157 46 Right 2
WINDOW 123 238 76 Right 2
SYMATTR InstName M1
SYMATTR Value nfet
SYMATTR Value2 l=180n w=360n
SYMBOL pmos4 400 -208 M180
WINDOW 0 116 21 Right 2
WINDOW 3 151 49 Right 2
WINDOW 123 206 76 Right 2
SYMATTR InstName M2
SYMATTR Value pfet
SYMATTR Value2 l=180n w=720n
SYMBOL voltage 256 -416 R0
WINDOW 123 0 0 Left 0
WINDOW 39 0 0 Left 0
SYMATTR InstName V1
SYMATTR Value 1.8
TEXT 504 8 Left 2 !.lib "D:\\MIT MICRO\\vsd internship\\osu180_lib\\osu018.lib"

cs_inv.asc, the sub-circuit schematic file:
Version 4
SHEET 1 6288 680
WIRE 656 -752 432 -752
WIRE 432 -656 432 -752
WIRE 656 -496 656 -752
WIRE 608 -480 544 -480
WIRE 656 -384 656 -400
WIRE 608 -288 608 -368
WIRE 608 -288 528 -288
WIRE 864 -288 656 -288
WIRE 912 -288 864 -288
WIRE 864 -240 864 -288
WIRE 608 -208 608 -288
WIRE 656 -176 656 -192
WIRE 864 -144 864 -176
WIRE 608 -96 544 -96
WIRE 656 48 656 -80
FLAG 656 -128 0
FLAG 656 -448 VDD
FLAG 656 -336 VDD
FLAG 656 -240 0
FLAG 528 -288 In
IOPIN 528 -288 In
FLAG 544 -480 Vp
IOPIN 544 -480 In
FLAG 544 -96 Vn
IOPIN 544 -96 In
FLAG 912 -288 Out
IOPIN 912 -288 Out
FLAG 864 -144 0
FLAG 432 -576 0
FLAG 656 48 0
SYMBOL nmos4 608 -176 R0
WINDOW 0 104 24 Right 2
WINDOW 3 179 41 Right 2
WINDOW 123 213 74 Right 2
SYMATTR InstName M1
SYMATTR Value nfet
SYMATTR Value2 l=180n w=360n
SYMBOL pmos4 608 -400 M180
WINDOW 0 88 9 Right 2
WINDOW 3 168 20 Right 2
WINDOW 123 206 76 Right 2
SYMATTR InstName M4
SYMATTR Value pfet
SYMATTR Value2 l=180n w=720n
SYMBOL pmos4 608 -288 M180
WINDOW 0 88 9 Right 2
WINDOW 3 168 20 Right 2
WINDOW 123 206 76 Right 2
SYMATTR InstName M3
SYMATTR Value pfet
SYMATTR Value2 l=180n w=720n
SYMBOL nmos4 608 -288 R0
WINDOW 0 104 24 Right 2
WINDOW 3 179 41 Right 2
WINDOW 123 213 74 Right 2
SYMATTR InstName M2
SYMATTR Value nfet
SYMATTR Value2 l=180n w=360n
SYMBOL cap 848 -240 R0
SYMATTR InstName C1
SYMATTR Value 1f
SYMBOL voltage 432 -672 R0
WINDOW 123 0 0 Left 0
WINDOW 39 0 0 Left 0
SYMATTR InstName V1
SYMATTR Value 1.8
TEXT 712 -56 Left 2 !.lib "D:\\MIT MICRO\\vsd internship\\osu180_lib\\osu018.lib"
TEXT 912 -216 Left 2 ;model parasitic C\n(important)

freq_div_2.asc, the sub-circuit schematic file:
Version 4
SHEET 1 1824 680
WIRE 1680 -880 -112 -880
WIRE 1120 -688 1120 -720
WIRE 1120 -688 1088 -688
WIRE 1216 -688 1216 -720
WIRE 1632 -688 1216 -688
WIRE 1120 -656 1120 -688
WIRE 1216 -656 1216 -688
WIRE 272 -640 272 -672
WIRE 272 -640 240 -640
WIRE 368 -640 368 -672
WIRE 768 -640 368 -640
WIRE 272 -608 272 -640
WIRE 368 -608 368 -640
WIRE 1296 -544 1264 -544
WIRE 1504 -544 1472 -544
WIRE 448 -496 416 -496
WIRE 656 -496 624 -496
WIRE 1088 -496 1088 -688
WIRE 1264 -496 1264 -544
WIRE 1264 -496 1088 -496
WIRE 1344 -496 1344 -528
WIRE 1440 -496 1344 -496
WIRE 1472 -496 1472 -544
WIRE 1472 -496 1440 -496
WIRE 1552 -496 1552 -528
WIRE 1632 -496 1632 -688
WIRE 1632 -496 1552 -496
WIRE 1680 -496 1680 -880
WIRE 1680 -496 1632 -496
WIRE 1728 -496 1680 -496
WIRE 912 -480 912 -512
WIRE 912 -480 800 -480
WIRE 240 -448 240 -640
WIRE 416 -448 416 -496
WIRE 416 -448 240 -448
WIRE 496 -448 496 -480
WIRE 576 -448 496 -448
WIRE 624 -448 624 -496
WIRE 624 -448 576 -448
WIRE 704 -448 704 -480
WIRE 768 -448 768 -640
WIRE 768 -448 704 -448
WIRE 912 -448 912 -480
WIRE 1008 -448 1008 -512
WIRE 1088 -448 1088 -496
WIRE 1088 -448 1008 -448
WIRE 1264 -416 1264 -496
WIRE 1296 -416 1264 -416
WIRE 1472 -416 1472 -496
WIRE 1504 -416 1472 -416
WIRE -112 -400 -112 -880
WIRE 0 -400 -112 -400
WIRE 64 -400 64 -464
WIRE 64 -400 0 -400
WIRE 160 -400 160 -464
WIRE 240 -400 240 -448
WIRE 240 -400 160 -400
WIRE 416 -368 416 -448
WIRE 448 -368 416 -368
WIRE 624 -368 624 -448
WIRE 656 -368 624 -368
WIRE 1344 -352 1344 -400
WIRE 1552 -352 1552 -400
WIRE 496 -304 496 -352
WIRE 704 -304 704 -352
WIRE 1440 -304 1440 -496
WIRE 1728 -304 1440 -304
WIRE 576 -256 576 -448
WIRE 800 -256 800 -480
WIRE 800 -256 576 -256
WIRE 16 -240 16 -256
WIRE 16 -224 16 -240
WIRE 16 -112 16 -144
WIRE 656 -16 656 -96
WIRE 688 -16 656 -16
WIRE 656 0 656 -16
WIRE 688 48 688 -16
WIRE 688 48 656 48
WIRE 608 80 560 80
WIRE 560 112 560 80
WIRE 560 112 416 112
WIRE 656 112 656 96
WIRE 784 112 656 112
WIRE 656 128 656 112
WIRE 688 176 656 176
WIRE 560 208 560 112
WIRE 608 208 560 208
WIRE 656 240 656 224
WIRE 688 240 688 176
WIRE 688 240 656 240
WIRE 656 304 656 240
FLAG 496 -400 0
FLAG 16 -112 0
FLAG 16 -240 VDD
FLAG 496 -528 VDD
FLAG 496 -304 0
FLAG 496 -576 VDD
FLAG 704 -400 0
FLAG 704 -528 VDD
FLAG 704 -304 0
FLAG 704 -576 VDD
FLAG 112 -400 0
FLAG 0 -400 D
FLAG 144 -352 clock_b
FLAG 784 112 clock_b
FLAG 416 112 clock
FLAG 112 -464 VDD
FLAG 80 -512 clock
FLAG 320 -608 0
FLAG 352 -560 clock
FLAG 320 -672 VDD
FLAG 288 -720 clock_b
FLAG 1344 -448 0
FLAG 1344 -576 VDD
FLAG 1344 -352 0
FLAG 1344 -624 VDD
FLAG 1552 -448 0
FLAG 1552 -576 VDD
FLAG 1552 -352 0
FLAG 1552 -624 VDD
FLAG 960 -448 0
FLAG 992 -400 clock
FLAG 1728 -496 Q_bar
FLAG 1728 -304 Q
FLAG 960 -512 VDD
FLAG 928 -560 clock_b
FLAG 1168 -656 0
FLAG 1200 -608 clock_b
FLAG 1168 -720 VDD
FLAG 1136 -768 clock
FLAG 656 304 0
FLAG 656 -96 VDD
SYMBOL nmos4 448 -448 R0
WINDOW 0 104 24 Invisible 2
WINDOW 3 179 41 Invisible 2
SYMATTR InstName M1
SYMATTR Value nfet
SYMATTR Value2 l=180n w=180n
SYMBOL voltage 16 -240 R0
WINDOW 123 0 0 Left 2
WINDOW 39 0 0 Left 2
SYMATTR InstName VDD
SYMATTR Value 1.8
SYMBOL pmos4 448 -576 R0
WINDOW 0 88 9 Invisible 2
WINDOW 3 168 20 Invisible 2
SYMATTR InstName M2
SYMATTR Value pfet
SYMATTR Value2 l=180n w=540n
SYMBOL nmos4 656 -448 R0
WINDOW 0 104 24 Right 2
WINDOW 3 179 41 Invisible 2
SYMATTR InstName M5
SYMATTR Value nfet
SYMATTR Value2 l=180n w=180n
SYMBOL pmos4 656 -576 R0
WINDOW 0 88 9 Invisible 2
WINDOW 3 168 20 Invisible 2
SYMATTR InstName M6
SYMATTR Value pfet
SYMATTR Value2 l=180n w=540n
SYMBOL nmos4 64 -352 R270
WINDOW 0 86 42 Invisible 2
WINDOW 3 82 140 Invisible 2
SYMATTR InstName M7
SYMATTR Value nfet
SYMATTR Value2 l=180n w=180n
SYMBOL pmos4 160 -512 R90
WINDOW 0 71 26 Invisible 2
WINDOW 3 75 133 Invisible 2
SYMATTR InstName M3
SYMATTR Value pfet
SYMATTR Value2 l=180n w=540n
SYMBOL nmos4 272 -560 R270
WINDOW 0 86 42 Invisible 2
WINDOW 3 82 140 Invisible 2
SYMATTR InstName M4
SYMATTR Value nfet
SYMATTR Value2 l=180n w=180n
SYMBOL pmos4 368 -720 R90
WINDOW 0 71 26 Invisible 2
WINDOW 3 75 133 Invisible 2
SYMATTR InstName M8
SYMATTR Value pfet
SYMATTR Value2 l=180n w=540n
SYMBOL nmos4 1296 -496 R0
WINDOW 0 104 24 Invisible 2
WINDOW 3 179 41 Invisible 2
SYMATTR InstName M9
SYMATTR Value nfet
SYMATTR Value2 l=180n w=180n
SYMBOL pmos4 1296 -624 R0
WINDOW 0 88 9 Invisible 2
WINDOW 3 168 20 Invisible 2
SYMATTR InstName M10
SYMATTR Value pfet
SYMATTR Value2 l=180n w=540n
SYMBOL nmos4 1504 -496 R0
WINDOW 0 104 24 Right 2
WINDOW 3 179 41 Invisible 2
SYMATTR InstName M11
SYMATTR Value nfet
SYMATTR Value2 l=180n w=180n
SYMBOL pmos4 1504 -624 R0
WINDOW 0 88 9 Invisible 2
WINDOW 3 168 20 Invisible 2
SYMATTR InstName M12
SYMATTR Value pfet
SYMATTR Value2 l=180n w=540n
SYMBOL nmos4 912 -400 R270
WINDOW 0 86 42 Invisible 2
WINDOW 3 82 140 Invisible 2
SYMATTR InstName M13
SYMATTR Value nfet
SYMATTR Value2 l=180n w=180n
SYMBOL pmos4 1008 -560 R90
WINDOW 0 71 26 Invisible 2
WINDOW 3 75 133 Invisible 2
SYMATTR InstName M14
SYMATTR Value pfet
SYMATTR Value2 l=180n w=540n
SYMBOL nmos4 1120 -608 R270
WINDOW 0 86 42 Invisible 2
WINDOW 3 82 140 Invisible 2
SYMATTR InstName M15
SYMATTR Value nfet
SYMATTR Value2 l=180n w=180n
SYMBOL pmos4 1216 -768 R90
WINDOW 0 71 26 Invisible 2
WINDOW 3 75 133 Invisible 2
SYMATTR InstName M16
SYMATTR Value pfet
SYMATTR Value2 l=180n w=540n
SYMBOL nmos4 608 128 R0
SYMATTR InstName M17
SYMATTR Value nfet
SYMATTR Value2 l=180n w=180n
SYMBOL pmos4 608 0 R0
SYMATTR InstName M18
SYMATTR Value pfet
SYMATTR Value2 l=180n w=540n
TEXT 992 -160 Left 2 !.lib osu018.lib

The netlist it stands for:
* Final_PLL_501.asc
XX1 5MHz f_VCO/8 up down pfd_501
XX2 up down Vin_vco charge_pump
XX3 Vin_vco f_out vco_19_16
XX5 f_out N003 freq_div_2
XX6 N003 N002 freq_div_2
XX7 N002 f_VCO/8 freq_div_2
V1 5MHz 0 PULSE(0 1.8 10p 10p 10p 100n 200n)
V2 10MHz 0 PULSE(0 1.8 10p 10p 10p 50n 100n)
V3 12MHz 0 PULSE(0 1.8 10p 10p 10p 41.665n 83.33n)
C1 Vin_vco 0 200p
C2 N001 0 500p
R1 Vin_vco N001 500

* block symbol definitions
.subckt pfd_501 f_clk_in f_VCO up down
XX1 N001 N005 N002 vddd 0 nand101
XX2 N002 N008 N006 vddd 0 nand101
XX3 N006 N007 N008 vddd 0 nand101
XX4 N007 N010 N011 vddd 0 nand101
XX5 N011 N009 N010 vddd 0 nand101
XX6 N013 N012 N009 vddd 0 nand101
XX7 f_clk_in N005 vddd 0 inv101
XX8 f_VCO N013 vddd 0 inv101
XX9 N002 N003 vddd 0 inv101
XX10 N003 N004 vddd 0 inv101
XX11 N009 N014 vddd 0 inv101
XX12 N014 N015 vddd 0 inv101
XX13 N004 N006 N007 N001 vddd 0 nand301
XX14 N007 N010 N015 N012 vddd 0 nand301
XX15 N012 down vddd 0 inv101
XX16 N006 N002 N009 N010 vddd 0 N007 nand401
XX17 N001 up vddd 0 inv101
V1 NC_01 0 pulse 0 1 0 100p 100p 5n 10n
V2 NC_02 0 pulse 0 1 2n 100p 100p 5n 9n
V3 vddd 0 1.8
.tran 50n
.ends pfd_501

.subckt nand101 in1 in2 out VDD GND
M1 out in1 N001 N001 nfet l=180n w=180n
M2 VDD in2 out VDD pfet l=180n w=360n
M3 VDD in1 out VDD pfet l=180n w=360n
M4 N001 in2 GND GND nfet l=180n w=360n
.lib "D:\MIT MICRO\vsd internship\osu180_lib\osu018.lib"
* W=360nm, L=180nm
* W=360nm, L=180nm
* W=360nm, L=180nm
* W=360nm, L=180nm
.ends nand101

.subckt inv101 in out VDD GND
M1 out in GND GND nfet l=180n w=180n
M2 VDD in out VDD pfet l=180n w=360n
.lib osu018.lib
* W=180nm, L=180nm
* W=360nm, L=180nm
.ends inv101

.subckt nand301 in1 in2 in3 out VDD GND
M1 out in1 N001 N001 nfet l=180n w=540n
M2 VDD in2 out VDD pfet l=180n w=360n
M3 VDD in1 out VDD pfet l=180n w=360n
M4 N001 in2 N002 N002 nfet l=180n w=540n
M5 N002 in3 GND GND nfet l=180n w=540n
M6 VDD in3 out VDD pfet l=180n w=360n
.lib osu018.lib
* W=540n  L=180n
* W=360nm, L=180nm
* W=540n  L=180n
* W=360nm, L=180nm
* W=540n  L=180n
* W=360n  L=180n
* 3 Input NAND
* PMOS >>> 2:1
* NMOS >>> 3:1
.ends nand301

.subckt nand401 in1 in2 in3 in4 VDD GND out
M1 out in1 N001 N001 nfet l=180n w=720n
M2 VDD in2 out VDD pfet l=180n w=360n
M3 VDD in1 out VDD pfet l=180n w=360n
M4 N001 in2 N002 N002 nfet l=180n w=720n
M5 N002 in3 N003 N003 nfet l=180n w=720n
M6 VDD in3 out VDD pfet l=180n w=360n
M7 N003 in4 GND GND nfet l=180n w=720n
M8 VDD in4 out VDD pfet l=180n w=360n
.lib osu018.lib
* W=720n  L=180n
* W=360nm, L=180nm
* W=720n  L=180n
* W=360nm, L=180nm
* W=720n  L=180n
* W=360n  L=180n
* 4 Input NAND
* PMOS >>> 2:1
* NMOS >>> 4:1
* W=720n  L=180n
.ends nand401

.subckt charge_pump UP Down CP
M7 UP_bar UP 0 0 nfet l=180n w=180n
M8 DOWN_bar Down 0 0 nfet l=180n w=180n
M12 VDD Down DOWN_bar VDD pfet l=180n w=540n
M14 VDD UP UP_bar VDD pfet l=180n w=540n
M15 UP_bar 0 N001 N001 nfet l=180n w=180n
M16 DOWN_bar 0 N004 N004 nfet l=180n w=180n
M17 N003 N004 N003 N003 nfet l=180n w=180n
M18 0 VDD VDD 0 nfet l=180n w=180n
M19 CP VDD N003 N003 nfet l=180n w=180n
M20 N003 Down 0 0 nfet l=180n w=15u
M21 N001 VDD UP_bar N001 pfet l=180n w=540n
M22 N004 VDD DOWN_bar N004 pfet l=180n w=540n
M23 N002 UP N002 N002 pfet l=180n w=540n
M24 0 0 VDD VDD pfet l=180n w=540n
M25 N002 0 CP N002 pfet l=180n w=540n
M26 VDD N001 N002 VDD pfet l=180n w=45u
V1 VDD 0 1.8
.lib "D:\MIT MICRO\vsd internship\osu180_lib\osu018.lib"
.ends charge_pump

.subckt vco_19_16 Vinvco osc
M7 Vp Vn 0 0 nfet l=180n w=360n
M8 Vp Vp VDD VDD pfet l=180n w=1800n
R1 Vn Vinvco 1
XU22 osc_fb osc inv_20_10
XX3 n1 osc_fb Vp Vn cs_inv
XX16 N005 n1 Vp Vn cs_inv
XX17 N004 N005 Vp Vn cs_inv
XX18 N003 N004 Vp Vn cs_inv
XX19 N002 N003 Vp Vn cs_inv
XX20 N001 N002 Vp Vn cs_inv
XX21 osc_fb N001 Vp Vn cs_inv
V1 VDD 0 1.8
.lib osu018.lib
.ends vco_19_16

.subckt inv_20_10 In Out
M1 Out In 0 0 nfet l=180n w=360n
M2 Out In N001 N001 pfet l=180n w=720n
V1 N001 0 1.8
.lib "D:\MIT MICRO\vsd internship\osu180_lib\osu018.lib"
.ends inv_20_10

.subckt cs_inv In Out Vp Vn
M1 N003 Vn 0 0 nfet l=180n w=360n
M4 N002 Vp N001 VDD pfet l=180n w=720n
M3 Out In N002 VDD pfet l=180n w=720n
M2 Out In N003 0 nfet l=180n w=360n
C1 Out 0 1f
V1 N001 0 1.8
.lib "D:\MIT MICRO\vsd internship\osu180_lib\osu018.lib"
* model parasitic C
* (important)
.ends cs_inv

.subckt freq_div_2 clock Q
M1 N004 N002 0 0 nfet l=180n w=180n
VDD VDD 0 1.8
M2 VDD N002 N004 VDD pfet l=180n w=540n
M5 N003 N004 0 0 nfet l=180n w=180n
M6 VDD N004 N003 VDD pfet l=180n w=540n
M7 Q_bar clock_b N002 0 nfet l=180n w=180n
M3 N002 clock Q_bar VDD pfet l=180n w=540n
M4 N002 clock N003 0 nfet l=180n w=180n
M8 N003 clock_b N002 VDD pfet l=180n w=540n
M9 Q N001 0 0 nfet l=180n w=180n
M10 VDD N001 Q VDD pfet l=180n w=540n
M11 Q_bar Q 0 0 nfet l=180n w=180n
M12 VDD Q Q_bar VDD pfet l=180n w=540n
M13 N004 clock N001 0 nfet l=180n w=180n
M14 N001 clock_b N004 VDD pfet l=180n w=540n
M15 N001 clock_b Q_bar 0 nfet l=180n w=180n
M16 Q_bar clock N001 VDD pfet l=180n w=540n
M17 clock_b clock 0 0 nfet l=180n w=180n
M18 VDD clock clock_b VDD pfet l=180n w=540n
.lib osu018.lib
.ends freq_div_2

.model NMOS NMOS
.model PMOS PMOS
.lib standard.mos
.tran 5u
.ic V(vin_vco) = 0
.backanno
.end